# Altium schematic sheet 25mW VTX.SchDoc
size A4
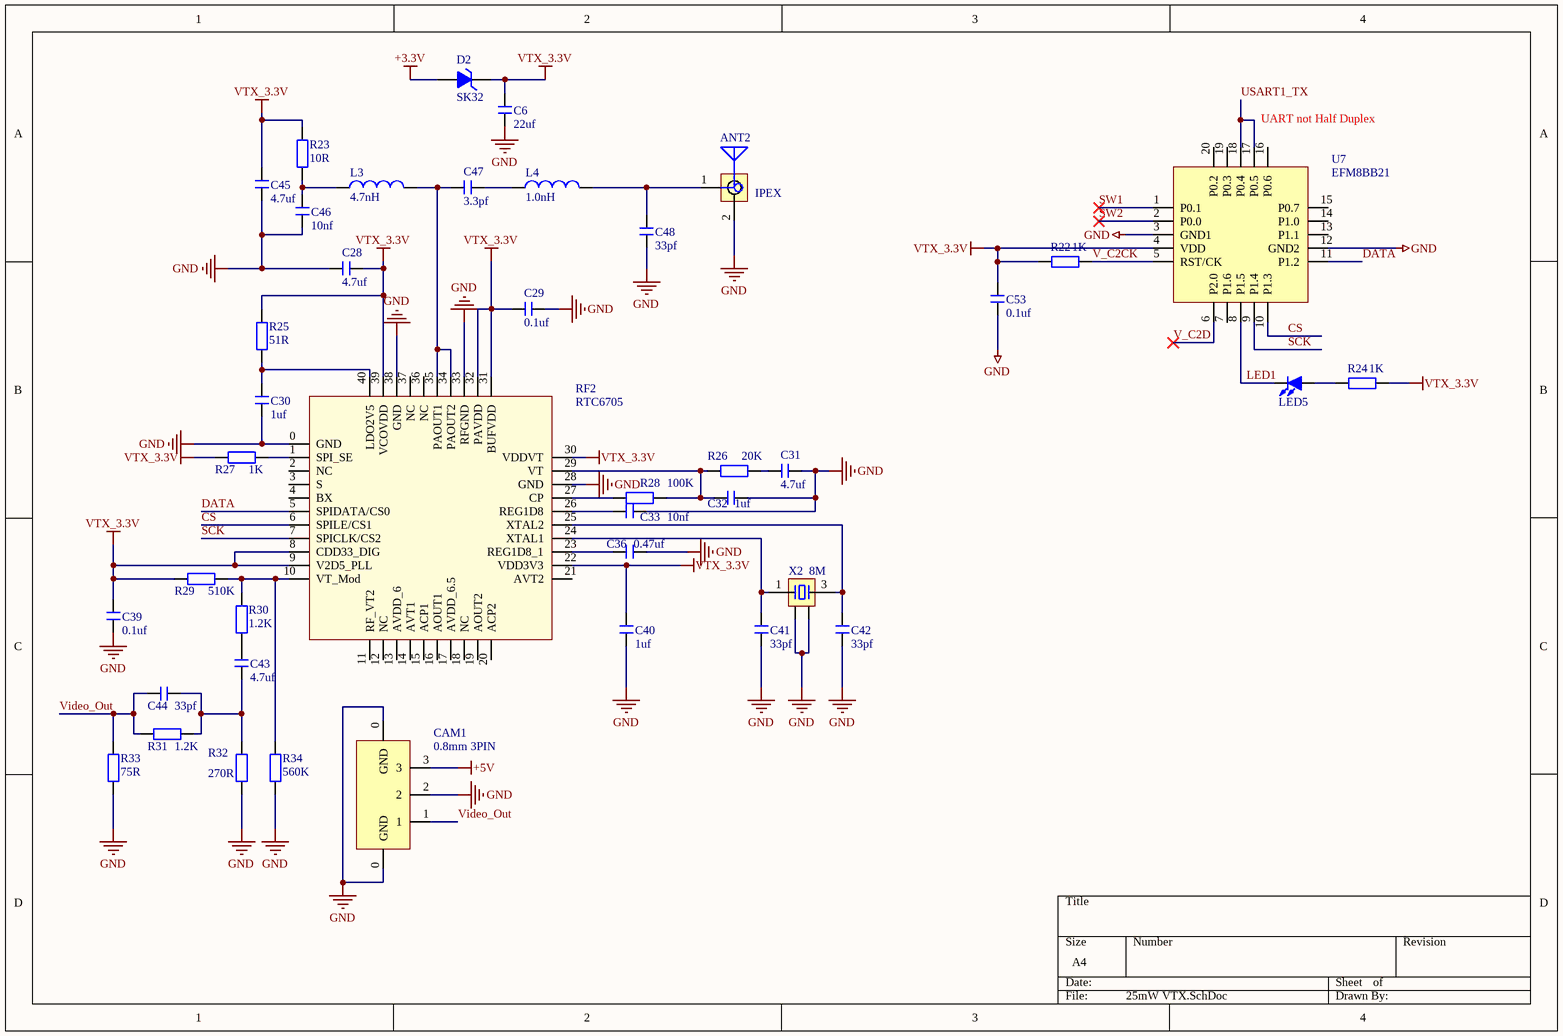
[diagram p0: 25mW VTX.SchDoc]

## Parts
ANT2  IPEX  [L - IPEX]
C6  22uf  [0402-C-S-1.33*0.5]
C28  4.7uf  [0402-C-S-1.33*0.5]
C29  0.1uf  [0402-C-S-1.33*0.5]
C30  1uf  [0402-C-S-1.33*0.5]
C31  4.7uf  [0402-C-S-1.33*0.5]
C32  1uf  [0402-C-S-1.33*0.5]
C33  10nf  [0402-C-S-1.33*0.5]
C36  0.47uf  [0402-C-S-1.33*0.5]
C39  0.1uf  [0402-C-S-1.33*0.5]
C40  1uf  [0402-C-S-1.33*0.5]
C41  33pf  [0402-C-S-1.33*0.5]
C42  33pf  [0402-C-S-1.33*0.5]
C43  4.7uf  [0402-C-S-1.33*0.5]
C44  33pf  [0402-C-S-1.33*0.5]
C45  4.7uf  [0402-C-S-1.33*0.5]
C46  10nf  [0402-C-S-1.33*0.5]
C47  3.3pf  [0402-C-S-1.33*0.5]
C48  33pf  [0402-C-S-1.33*0.5]
C53  0.1uf  [0402-C-S-1.33*0.5]
CAM1  0.8mm 3PIN  [PCBComponent_1]
D2  SK32  [SOD-123]
L3  4.7nH  [0402-L-1.6*0.5]
L4  1.0nH  [0402-L-1.6*0.5]
LED5  LED  [L-LED 0603B]  (value not drawn)
R22  1K  [0402-R-1.38*0.5]
R23  10R  [0402-R-1.38*0.5]
R24  1K  [0402-R-1.38*0.5]
R25  51R  [0402-R-1.38*0.5]
R26  20K  [0402-R-1.38*0.5]
R27  1K  [0402-R-1.38*0.5]
R28  100K  [0402-R-1.38*0.5]
R29  510K  [0402-R-1.38*0.5]
R30  1.2K  [0402-R-1.38*0.5]
R31  1.2K  [0402-R-1.38*0.5]
R32  270R  [0402-R-1.38*0.5]
R33  75R  [0402-R-1.38*0.5]
R34  560K  [0402-R-1.38*0.5]
RF2  RTC6705  [L - QFN40 6*6]
U7  EFM8BB21  [L - QFN20]
X2  8M  [OSC 3225-4P]

## Nets
+3.3V: D2.1
+5V: CAM1.3
GND: ANT2.2(GND) C6.2 C28.2 C29.1 C30.1 C31.1 C32.2 C33.2 C36.1 C39.2 C40.1 C41.1 C42.1 C45.2 C46.2 C48.2 C53.1 CAM1.0(GND) CAM1.2 R32.1 R33.1 R34.1 RF2.0(GND) RF2.28(GND) RF2.33(RFGND) RF2.38(GND) U7.3(GND1) U7.12(GND2) X2.2 X2.4
VTX_3.3V: C6.1 C28.1 C29.2 C39.1 C40.2 C45.1 C53.2 D2.2 R22.2 R23.2 R24.1 R25.2 R27.1 R29.1 RF2.8(CDD33_DIG) RF2.9(V2D5_PLL) RF2.22(VDD3V3) RF2.30(VDDVT) RF2.31(BUFVDD) RF2.32(PAVDD) RF2.39(VCOVDD) U7.4(VDD)
CS: RF2.6(SPILE/CS1) U7.10(P1.3)
DATA: RF2.5(SPIDATA/CS0) U7.11(P1.2)
LED1: LED5.2(K) U7.8(P1.5)
SCK: RF2.7(SPICLK/CS2) U7.9(P1.4)
SW1: U7.1(P0.1)
SW2: U7.2(P0.0)
USART1_TX: U7.17(P0.5) U7.18(P0.4)
V_C2CK: R22.1 U7.5(RST/CK)
V_C2D: U7.6(P2.0)
Video_Out: C44.2 CAM1.1 R31.2 R33.2
NetANT2_1: ANT2.1(ANT) C48.1 L4.2
NetC30_2: C30.2 R25.1 RF2.40(LDO2V5)
NetC31_2: C31.2 R26.1
NetC32_1: C32.1 R26.2 R28.1 RF2.29(VT)
NetC33_1: C33.1 RF2.26(REG1D8)
NetC36_2: C36.2 RF2.23(REG1D8_1)
NetC41_2: C41.2 RF2.24(XTAL1) X2.1
NetC42_2: C42.2 RF2.25(XTAL2) X2.3
NetC43_1: C43.1 C44.1 R31.1 R32.2
NetC43_2: C43.2 R30.1
NetC46_1: C46.1 L3.1 R23.1
NetC47_1: C47.1 L4.1
NetC47_2: C47.2 L3.2 RF2.34(PAOUT2) RF2.35(PAOUT1)
NetLED5_1: LED5.1(A) R24.2
NetR27_2: R27.2 RF2.1(SPI_SE)
NetR28_2: R28.2 RF2.27(CP)
NetR29_2: R29.2 R30.2 R34.2 RF2.10(VT_Mod)

Not connected (* = marked no-connect by the designer): RF2 2(NC) 3(S) 4(BX) 11(RF_VT2) 12(NC) 13(AVDD_6) 14(AVT1) 15(ACP1) 16(AOUT1) 17(AVDD_6.5) 18(NC) 19(AOUT2) 20(ACP2) 21(AVT2) 36(NC) 37(NC); U7 7(P1.6) 13(P1.1) 14(P1.0) 15(P0.7) 16(P0.6) 19(P0.3) 20(P0.2)

## Notes on the sheet
- (near U7) UART not Half Duplex

## Library data of the parts
C6 C28-C33 C36 C39-C48 C53 = C
CAM1 = Component_1
D2 = 1N4148WT
L3 L4 = L
LED5 = LED-2PIN
R22-R34 = R
X2 = XTAL-4P: 4脚无源晶振; 版权归属: 源创客; 负载电容: CL20pF; BOM名称: 4脚无源晶振; 学习资源: www.ooocke.com